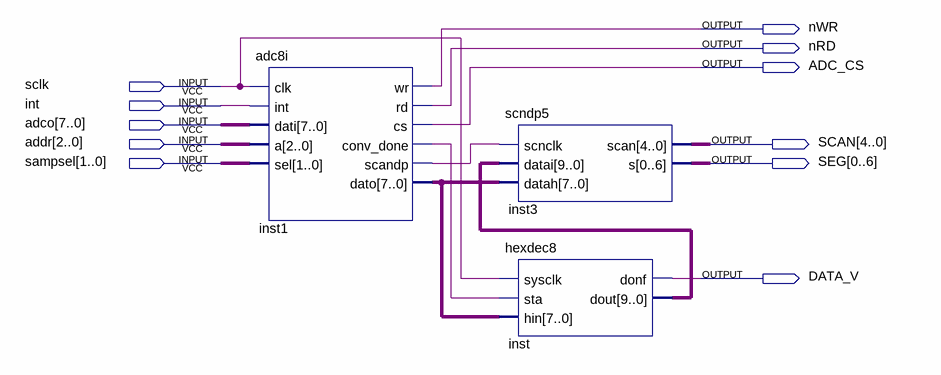
[diagram p0: schematic sheet]
// Quartus schematic adc8dp.bdf as structural Verilog: 3 symbols, 11 pins
module adc8dp (
  input  sclk,
  input  \int ,
  input  [7:0] adco,
  input  [2:0] addr,
  input  [1:0] sampsel,
  output nWR,
  output nRD,
  output ADC_CS,
  output [4:0] SCAN,
  output [0:6] SEG,
  output DATA_V
);

  wire inst1_conv_done, inst1_scandp;
  wire [7:0] inst1_dato;
  wire [9:0] inst_dout;

  adc8i inst1 (
    .clk(sclk), .\int (\int ), .dati(adco), .a(addr), .sel(sampsel), .wr(nWR), .rd(nRD), .cs(ADC_CS),
    .conv_done(inst1_conv_done), .scandp(inst1_scandp), .dato(inst1_dato));
  scndp5 inst3 (.scnclk(inst1_scandp), .datai(inst_dout), .datah(inst1_dato), .scan(SCAN), .s(SEG));
  hexdec8 inst (.sysclk(sclk), .sta(inst1_conv_done), .hin(inst1_dato), .donf(DATA_V), .dout(inst_dout));
endmodule
